# Altium project ECEN404_FinalPCB.PrjPcb
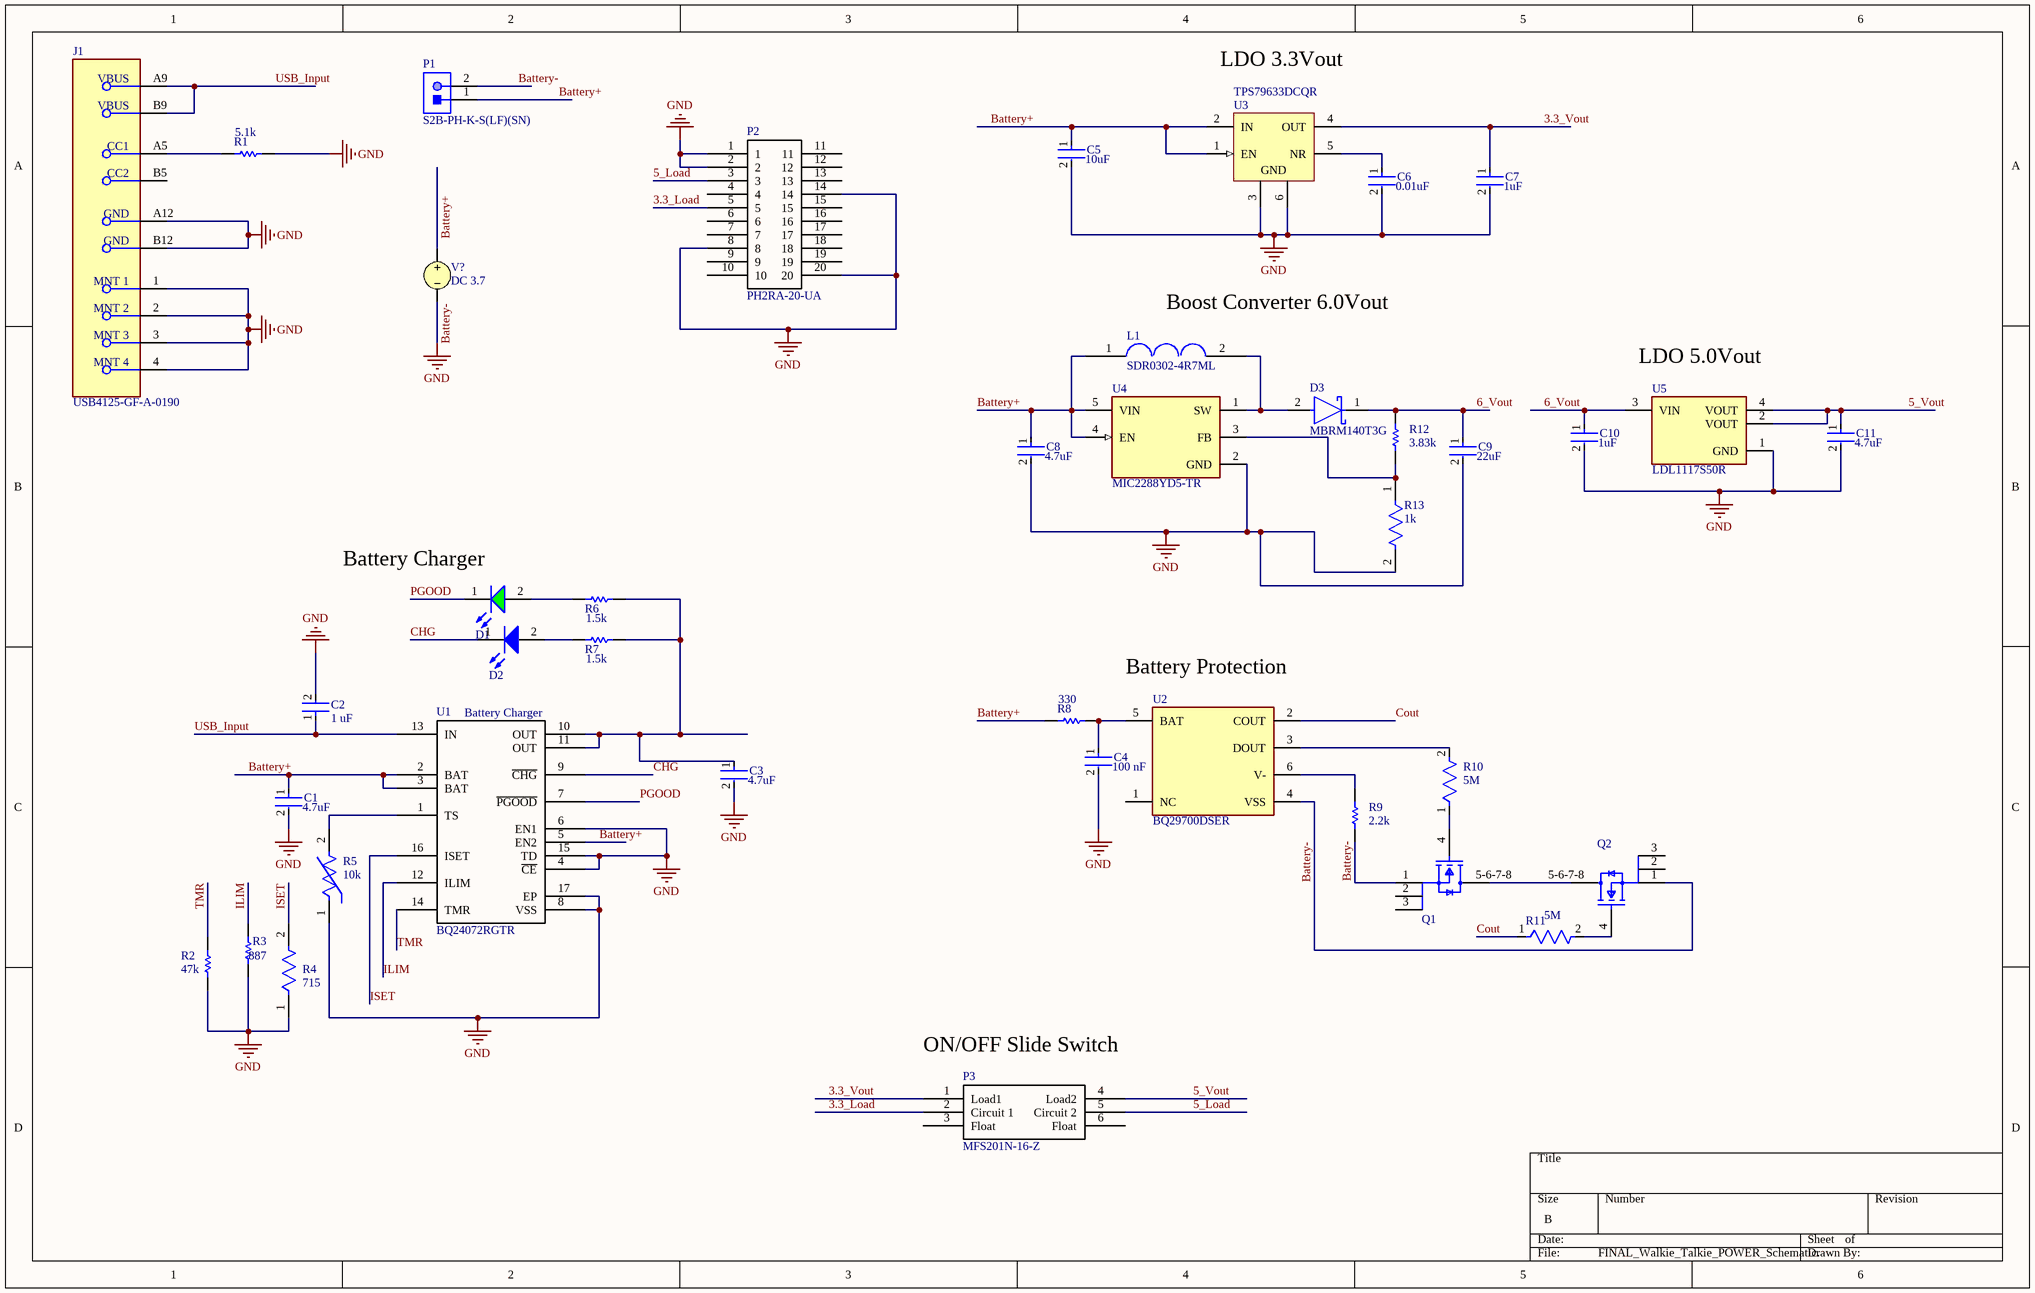
[diagram p0: FINAL_Walkie_Talkie_POWER_Schematic.SchDoc]
1 sheet, 40 parts. Net scope: global (net labels, ports and power ports of the same name join across sheets).
Board file: FINAL_Walkie_Talkie_POWER_PCB.PcbDoc

## Sheet FINAL_Walkie_Talkie_POWER_Schematic.SchDoc
size B; SheetNumber: 1; SheetTotal: 1

### Parts
C1  Capacitance: 4.7uF  [FP-0805-L_2_01_0_2-W_1_25-IPC_B]  (hidden comment: 08056D475MAT2A)
C2  Capacitance: 1 uF  [FP-CC0805-0_85-MFG]  (hidden comment: CC0805KKX7R7BB105)
C3  Capacitance: 4.7uF  [FP-0805-L_2_01_0_2-W_1_25-IPC_B]  (hidden comment: 08056D475MAT2A)
C4  value 100 nF  [FP-CC0603-DA-MFG]  (hidden comment: CC0603KRX7R7BB104)
C5  Capacitance: 10uF  [FP-GRM21B-0_1-MFG]  (hidden comment: GRM21BR61C106KE15K)
C6  Capacitance: 0.01uF  [FP-0603B103K500CT-IPC_C]  (hidden comment: 0603B103K500CT)
C7  Capacitance: 1uF  [FP-CL10-IPC_C]  (hidden comment: CL10B105KP8NNNC)
C8  Capacitance: 4.7uF  [FP-0805-L_2_01_0_2-W_1_25-IPC_B]  (hidden comment: 08056D475MAT2A)
C9  Capacitance: 22uF  [FP-CL21-IPC_A]  (hidden comment: CL21A226MQQNNNE)
C10  Capacitance: 1uF  [FP-CL10-IPC_C]  (hidden comment: CL10B105KP8NNNC)
C11  Capacitance: 4.7uF  [FP-0805-L_2_01_0_2-W_1_25-IPC_B]  (hidden comment: 08056D475MAT2A)
D1  150060GS75000  [WL-SMCW_0603_150060xx75000]  (value not drawn)
D2  150060BS75000  [WL-SMCW_0603_150060xx75000]  (value not drawn)
D3  MBRM140T3G  [FP-457-04-MFG]
J1  USB4125-GF-A-0190  [FP-USB4125-GF-A-0190-MFG]
L1  SDR0302-4R7ML  [SDR0302-4R7ML]
P1  S2B-PH-K-S(LF)(SN)  [JST-S2B-PH-K-S_V]
P2  PH2RA-20-UA  [PH2RA-20-UA]
P3  MFS201N-16-Z  [MFS201N-16-Z]
Q1  CSD16406Q3  [FP-DQG0008A-MFG]  (value not drawn)
Q2  CSD16406Q3  [FP-DQG0008A-MFG]  (value not drawn)
R1  RC0603FR-075K1L  [RESC1608X55X25ML10T15]  (value not drawn)
R2  RC0805FR-0747KL  [RESC2013X60X35NL10T20]  (value not drawn)
R3  RC0805FR-07887RL  [RESC2013X60X35ML10T20]  (value not drawn)
R4  Resistance: 715  [FP-RC0805-0_6-MFG]  (hidden comment: RC0805FR-07715RL)
R5  NCU18XH103F60RB  [FP-NCU18-0_15-MFG]  (value not drawn)
R6  RC0805FR-071K5L  [RESC2013X60X35LL10T20]  (value not drawn)
R7  RC0805FR-071K5L  [RESC2013X60X35LL10T20]  (value not drawn)
R8  Resistance: 330  [RESC2013X60X35LL10T20]  (hidden comment: RC0805FR-07330RL)
R9  Resistance: 2.2k  [RESC1608X55X25LL10T15]  (hidden comment: RC0603FR-072K2L)
R10  Resistance: 5M  [FP-RG3216-MFG]  (hidden comment: RG3216P-5004-B-T1)
R11  Resistance: 5M  [FP-RG3216-MFG]  (hidden comment: RG3216P-5004-B-T1)
R12  ERJ-3EKF3831V  [RESC1608X55X30NL15T15]  (value not drawn)
R13  Resistance: 1k  [FP-RC0603-0_55-IPC_C]  (hidden comment: RC0603FR-071KL)
U1  BQ24072RGTR  [BQ24072RGTR]
U2  BQ29700DSER  [FP-DSE0006A-IPC_B]
U3  TPS79633DCQR  [DCQ0006A_L]
U4  MIC2288YD5-TR  [FP-TSOT-5LD-PL-1-MFG]
U5  LDL1117S50R  [FP-SOT-223-0046067_14-MFG]
V?  DC 3.7

### Nets
Battery-: C1.2 C2.2 C3.2 C4.2 C5.2 C6.2 C7.2 C8.2 C9.2 C10.2 C11.2 J1.1(MNT_1) J1.2(MNT_2) J1.3(MNT_3) J1.4(MNT_4) J1.A12(GND) J1.B12(GND) P1.2 P2.1 P2.2 P2.8 P2.14 P2.20 Q1.1(S) Q2.1(S) R1.2 R2.1 R3.1 R4.1 R5.1 R9.1 R13.2 U1.4(~{CE}) U1.6(EN1) U1.8(VSS) U1.15(TD) U1.17(EP) U2.4(VSS) U3.3(GND) U3.6(GND) U4.2(GND) U5.1(GND) V?.2  [also labelled GND]
3.3_Load: P2.5 P3.2(Circuit_1)
3.3_Vout: C7.1 P3.1(Load1) U3.4(OUT)
5_Load: P2.3 P3.5(Circuit_2)
5_Vout: C11.1 P3.4(Load2) U5.2(VOUT) U5.4(VOUT)
6_Vout: C9.1 C10.1 D3.1(C) R12.2 U5.3(VIN)
Battery+: C1.1 C5.1 C8.1 L1.1 P1.1 R8.2 U1.2(BAT) U1.3(BAT) U1.5(EN2) U3.1(EN) U3.2(IN) U4.4(EN) U4.5(VIN) V?.1
CHG: D2.1(K) U1.9(~{CHG})
Cout: R11.1 U2.2(COUT)
ILIM: R3.2 U1.12(ILIM)
ISET: R4.2 U1.16(ISET)
PGOOD: D1.1(K) U1.7(~{PGOOD})
TMR: R2.2 U1.14(TMR)
USB_Input: C2.1 J1.A9(VBUS) J1.B9(VBUS) U1.13(IN)
NetC3_1: C3.1 R6.2 R7.2 U1.10(OUT) U1.11(OUT)
NetC4_1: C4.1 R8.1 U2.5(BAT)
NetC6_1: C6.1 U3.5(NR)
NetD1_2: D1.2(A) R6.1
NetD2_2: D2.2(A) R7.1
NetD3_2: D3.2(A) L1.2 U4.1(SW)
NetJ1_A5: J1.A5(CC1) R1.1
NetQ1_4: Q1.4(G) R10.1
NetQ1_5-6-7-8: Q1.5-6-7-8(D) Q2.5-6-7-8(D)
NetQ2_4: Q2.4(G) R11.2
NetR5_2: R5.2 U1.1(TS)
NetR9_2: R9.2 U2.6(V-)
NetR10_2: R10.2 U2.3(DOUT)
NetR12_1: R12.1 R13.1 U4.3(FB)

Not connected (* = marked no-connect by the designer): J1 B5(CC2); P2 4 6 7 9 10 11 12 13 15 16 17 18 19; P3 3(Float) 6(Float); Q1 2(S) 3(S); Q2 2(S) 3(S); U2 1(NC)

### Notes on the sheet
- LDO 3.3Vout
- (near R1) 5.1k
- (near L1) Boost Converter 6.0Vout
- (near U5) LDO 5.0Vout
- 3.83k
- (near D1) Battery Charger
- 1.5k
- (near R7) 1.5k
- Battery Protection
- (near U1) Battery Charger
- (near R5) 10k
- (near R2) 47k
- (near R3) 887
- (near P3) ON/OFF Slide Switch

### Library data of the parts
C1 C3 C8 C11 = CMP-2007-04650-2: General Purpose Ceramic Capacitor, 0805, 4.7uF, 20%, X5R, 15%, 6.3V; Voltage Rating (DC): 6.3V; Package Quantity: 1; Case Code (Metric): 2012; Mount: Surface Mount; Lead Free: Lead Free; Series: -; Tolerance: 20%; Height: 1.4mm; Min Operating Temperature: -55°C; Termination: SMD/SMT; Width: 0.049inch; Case/Package: 0805; Dielectric: X5R; Packaging: Tape and Reel; Thickness: 0.055inch; Length: 2.01mm; Number of Pins: 2; Depth: 1.25mm; Radiation Hardening: No; Case Code (Imperial): 0805; Max Operating Temperature: 85°C; Voltage Rating: 6.3V; Construction: Flat; RoHS Compliant: Yes
C2 = CMP-03422-000001-1: CAP CER 1UF 16V X7R 0805; Manufacturer: Yageo; Material: Ceramic; Tolerance: 0.1; Voltage Rating: 16 V; Category: Cap; ComponentLink2Description: Datasheet; Automotive: No; Temperature Range High: +85°C; RoHS: TRUE; Footprint Url: http://www.yageo.com/exep/pages/download/literatures/UPY-C_GEN_24.pdf; Mouser Description: Multilayer Ceramic Capacitors MLCC - SMD/SMT 1.0uF 16V X7R 10%; Height: 0.95mm; Ipc Land Pattern Name: CAPC200125X85; Temperature: -30°C to +85°C; Lead Free: Yes; Value: 1 uF; Temperature Characteristic: X7R; Package: CC0805-0.85; Temperature Range Low: -30°C; Device Class L1: Passive Components; Device Class L3: Ceramic Capacitors; Octopart: https://octopart.com/cc0805kkx7r7bb105-yageo-8376555; Manufacturer Part Number: CC0805KKX7R7BB105; ComponentLink2URL: http://www.yageo.com/documents/recent/UPY-GPHC_Y5V_6.3V-to-50V_8.pdf; Device Class L2: Capacitors; Digikey Description: CAP CER 1UF 16V X7R 0805
C4 = CMP-2000-05002-2: CAP CER 0.1UF 16V X7R 0603; Manufacturer: YAGEO; Tolerance: 0.1; Temperature Coefficient: 15%; Material: Ceramic; Voltage Rating: 16 V; Package: CC0603-DA; ComponentLink2Description: Datasheet; Octopart: https://octopart.com/cc0603krx7r7bb104-yageo-192941; Temperature Range High: +125°C; Digikey Description: CAP CER 0.1UF 16V X7R 0603; Voltage: 16 V; Device Class L2: Capacitors; Height: 0.9mm; Temperature: -55°C to +125°C; Manufacturer Part Number: CC0603KRX7R7BB104; Device Class L1: Passive Components; Device Class L3: Ceramic Capacitors; ComponentLink2URL: http://www.yageo.com/documents/recent/UPY-GPHC_X7R_6.3V-to-50V_18.pdf; Footprint Url: http://www.yageo.com/exep/pages/download/literatures/UPY-C_GEN_24.pdf; RoHS: TRUE; Temperature Range Low: -55°C; Temperature Characteristic: X7R; Lead Free: Yes; Capacitance: 100 nF; Category: Cap; Mouser Description: Multilayer Ceramic Capacitor, CC Series, 0.1 - F, - 10%, X7R, 16 V, 0603 [1608 Metric]; Automotive: No
C5 = CMP-2007-03534-2: Chip Multilayer Ceramic Capacitors for General Purpose, 0805, 10uF, X5R, 15%, 10%, 16V; Case Code (Imperial): 0805; Packaging: Tape and Reel; Width: 0.049inch; Depth: 1.25mm; Voltage Rating: 16V; Height: 1.25mm; Case/Package: 0805; Max Operating Temperature: 85°C; Min Operating Temperature: -55°C; Tolerance: 10%; Dielectric: X5R; REACH SVHC: No SVHC; Mount: Surface Mount; Radiation Hardening: No; Case Code (Metric): 2012; Length: 2mm; Package Quantity: 10000; Voltage Rating (DC): 16V; Voltage: 16V; Thickness: 0.053inch; Termination: SMD/SMT
C6 = CMP-45632-000011-1: CAP CER 10000PF 50V X7R 0603; Tolerance: 10%; Insulation Resistance: 10GR; Dissipation Factor: 2.5%; Height: 0.8mm; Series: -; Lead Free: Lead Free; Voltage Rating (DC): 50V; Radiation Hardening: No; Dielectric: X7R; Length: 1.6mm; Termination: SMD/SMT; Case Code (Metric): 1608; Width: 0.8mm; Depth: 0.8mm; RoHS Compliant: Yes; Packaging: Tape and Reel; Case/Package: 0603; Voltage Rating: 50V; Max Operating Temperature: 125°C; Case Code (Imperial): 0603; Package Quantity: 4000; Min Operating Temperature: -55°C
C7 C10 = CMP-2000-06094-2: Cap Ceramic 1uF 10V X7R ±10% Pad SMD 0603 +125°C T/R; Packaging: Tape and Reel; Depth: 0.8mm; Voltage Rating: 10V; Lead Free: Lead Free; Radiation Hardening: No; Length: 1.6mm; Package Quantity: 1; Mount: Surface Mount; Case/Package: 0603; Max Operating Temperature: 125°C; Case Code (Metric): 1608; Height: 0.8mm; Min Operating Temperature: -55°C; Dielectric: X7R; Contact Plating: Tin; Case Code (Imperial): 0603; Thickness: 0.035inch; Voltage Rating (DC): 10V; Tolerance: 10%; Width: 0.031inch
C9 = CMP-13271-000185-1: CL21 Series 0805 22uF 6.3V ±20% Tolerance X5R Multilayer Ceramic Chip Capacitor; Height: 1.25mm; Length: 2mm; Mount: Surface Mount; Dielectric: X5R; Voltage Rating (DC): 6.3V; Case Code (Metric): 2012; Depth: 1.25mm; Max Operating Temperature: 85°C; Voltage Rating: 6.3V; Width: 0.049inch; Case/Package: 0805; Radiation Hardening: No; Thickness: 0.055inch; Packaging: Tape and Reel; Package Quantity: 2000; Lead Free: Lead Free; Contact Plating: Tin; Min Operating Temperature: -55°C; Case Code (Imperial): 0805; Tolerance: 20%
D1 = CMP-1426-00002-4: 430mcd Colorless transparence 520nm Emerald 140° LED0603 Light Emitting Diodes (LED) ROHS; Peak Wavelength: 515nm; Forward Current: 100mA; Reverse Voltage: 5V; Output Current: 10µA; Power Dissipation: 105mW; Lens Style: Clear, Rectangular; Dominant Wavelength: 525nm; Color: Green; Test Current: 20mA; Max Junction Temperature (Tj): 95°C; Forward Voltage: 3.2V; Width: 800µm; Max Operating Temperature: 85°C; Case Code (Metric): 1608; Luminous Intensity: 430mcd; Lead Free: Lead Free; Case/Package: 0603; Case Code (Imperial): 0603; Mount: Surface Mount; Max Reverse Voltage (DC): 5V; Packaging: Tape and Reel; RoHS: Compliant; Viewing Angle: 140°; REACH SVHC: Unknown; Min Operating Temperature: -40°C; Height: 700µm; Wavelength: 525nm; Length: 1.6mm
D2 = CMP-1426-00003-4: Led, Blue, 470 Nm, 3.2 V, 30 Ma, 145 Mcd Rohs Compliant: Yes; Peak Wavelength: 465nm; Dominant Wavelength: 470nm; Power Dissipation: 105mW; Viewing Angle: 140°; Test Current: 20mA; Max Junction Temperature (Tj): 95°C; Forward Current: 100mA; Reverse Voltage: 5V; Luminous Intensity: 145mcd; Lens Style: Clear, Rectangular; Forward Voltage: 3.2V; RoHS: Compliant; Min Operating Temperature: -40°C; REACH SVHC: Unknown; Max Operating Temperature: 85°C; Width: 800µm; Case Code (Imperial): 0603; Case Code (Metric): 1608; Max Reverse Voltage (DC): 5V; Height: 700µm; Case/Package: 0603; Mount: Surface Mount; Packaging: Tape and Reel; Color: Blue; Wavelength: 470nm; Length: 1.6mm
D3 = CMP-1055-00293-2: DIODE SCHOTTKY 40V 1A POWERMITE; Peak Non-Repetitive Surge Current: 50A; Forward Voltage: 550mV; Element Configuration: Single; Peak Reverse Current: 500uA; Polarity: Standard; Output Current: 1A; Number of Pins: 2; Lead Free: Lead Free; Package Quantity: 1; Width: 2.18mm; Current Rating: 1A; Min Operating Temperature: -55°C; Halogen Free: Halogen Free; Voltage Rating (DC): 40V; Max Repetitive Reverse Voltage (Vrrm): 40V; Forward Current: 1A; Radiation Hardening: No; Length: 2.05mm; Max Surge Current: 50A; Max Reverse Leakage Current: 500uA; Case/Package: 457; Packaging: Tape and Reel; Max Operating Temperature: 125°C; REACH SVHC: No SVHC; Height: 1.15mm; Max Forward Surge Current (Ifsm): 50A; Contact Plating: Tin; Average Rectified Current: 1A; Max Reverse Voltage (DC): 40V
J1 = CMP-245163-000004-1: CONN RCPT TYPE C 6P SMD RA
P1 = CMP-1755-00004-1: Male Header, Pitch 2 mm, 1 x 2 Position, Height 4.8 mm, Tail Length 3.4 mm, -25 to 85 degC, RoHS, Bulk; Case\Package: Radial; Tolerance: 20%; Capacitance: 10 uF; Voltage Rating (DC): 50 V; Packaging: Bulk; ComponentLink1URL: http://www.jst-mfg.com/product/pdf/eng/ePH.pdf; Radiation Hardening: No; Height: 11 mm; Package Quantity: 200; PackageDescription: Male Header, Pitch 2 mm, 1 x 2 Position, Height 4.8 mm, Tail Length 3.4 mm; PackageReference: S2B-PH-K-S; Diameter: 5 mm; Pins: 2; Mount: Through Hole; Max Operating Temperature: 85 degC; Min Operating Temperature: -40 degC; ComponentLink1Description: Datasheet; DatasheetVersion: Dec-12; Length: 11 mm; Lead Pitch: 2 mm; REACH SVHC: No SVHC; Voltage Rating: 50 V; RoHSCompliant: true
P3 = MFS201N-16-Z: Slide Switch Right Angle
Q1 Q2 = CMP-04962-000044-1: MOSFET N-CH 25V 60A 8-SON; Nominal Vgs: 1.7V; Power Dissipation: 2.7W; Element Configuration: Single; Input Capacitance: 1.1nF; Turn-Off Delay Time: 8.5ns; Number of Elements: 1; Rise Time: 12.9ns; Turn-On Delay Time: 7.3ns; Rds On Max: 5.3mR; Polarity: N-CHANNEL; Gate to Source Voltage (Vgs): 16V; Fall Time: 4.8ns; REACH SVHC: No SVHC; Max Operating Temperature: 150°C; Lead Free: Contains Lead; Contact Plating: Tin; Radiation Hardening: No; Series: NexFET™; Dual Supply Voltage: 25V; Mount: Surface Mount; Continuous Drain Current (ID): 60A; Threshold Voltage: 1.7V; RoHS Compliant: Yes; Package Quantity: 1; Min Operating Temperature: -55°C; Packaging: Tape and Reel; Number of Pins: 8; Termination: SMD/SMT; Max Power Dissipation: 2.7W; Case/Package: SON; Drain to Source Breakdown Voltage: 25V; Drain to Source Voltage (Vdss): 25V
R1 = CMP-2000-04091-1: Manufacturer: Yageo; Part Number: RC0603FR-075K1L
R2 = CMP-1659-00011-4: Chip Resistor, 47 KOhm, +/- 1%, 0.125 W, -55 to 155 degC, 0805 (2012 Metric), RoHS, Tape and Reel; Manufacturer: Yageo; Voltage Rating: 150 V; Height: 0.5 mm; ComponentLink2URL: http://www.yageo.com/documents/recent/PYu-RC_Group_51_RoHS_L_04.pdf; ComponentLink2Description: Datasheet; Package Quantity: 200; Max Operating Temperature: 155 degC; Min Operating Temperature: -55 degC; Packaging: Tape and Reel; Pins: 2; PackageReference: 0805; Mounting Technology: Surface Mount; ComponentLink1Description: Manufacturer URL; ComponentLink1URL: http://www.yageo.com/; PackageDescription: 2-Pin Surface Mounted Device, Body 2 x 1.25 mm; Length: 2 mm; REACH SVHC: No SVHC; Mount: Surface Mount; RoHSCompliant: true; DatasheetVersion: Rev. 4, 02/2016
R3 = CMP-2001-01292-1: Manufacturer: Yageo; Part Number: RC0805FR-07887RL
R4 = CMP-2001-01257-3: RES 715 OHM 1% 1/8W 0805; Max Power Dissipation: 125mW; Voltage Rating (DC): 150V; Temperature Coefficient: 100ppm/°C; Power Rating: 125mW; Packaging: Tape and Reel; Tolerance: 1%; Case Code (Imperial): 0805; Depth: 1.25mm; Size Code: 0805; Min Operating Temperature: -55°C; Features: Moisture Resistant; Height: 0.024inch; RoHS Compliant: Yes; Max Operating Temperature: 155°C; Length: 0.079inch; Number of Terminations: 2; Package Quantity: 1; Width: 0.049inch; Resistor Type: Thick Film; Lead Free: Lead Free; Contact Plating: Tin; Military Standard: Not; Case/Package: 0805; Voltage Rating: 150V; Case Code (Metric): 2012; Series: RC; Radiation Hardening: No; Termination: SMD/SMT; Construction: Rectangular
R5 = CMP-06022-000443-2: THERMISTOR NTC; Max Operating Temperature: 125°C; REACH SVHC: No SVHC; Case/Package: 0603; Min Operating Temperature: -40°C; RoHS Compliant: Yes; Case Code (Imperial): 0603; Case Code (Metric): 1608
R6 R7 = CMP-1659-00010-2: RES 1.50K OHM 1/8W 1% 0805 SMD; Manufacturer: Yageo; PackageReference: 0805; ComponentLink1URL: http://www.yageo.com/documents/recent/PYu-RC_Group_51_RoHS_L_04.pdf; ComponentLink1Description: Datasheet; PartNumber: RC0805FR-071K5L
R8 = CMP-2000-06960-1: Chip Resistor, 330 Ohm, +/- 1%, 125 mW, -55 to 155 degC, 0805 (2012 Metric), RoHS, Tape and Reel; Manufacturer: Yageo; Voltage Rating: 150V; Temperature Coefficient: 100PPM/C; Power Rating: 125mW(1/8W); Datasheet Version: Rev. 7, 05/2017; Termination Style: SMD/SMT; Case Code - mm: 2012; Package Description: 2-Pin Surface Mounted Device, Body 2 x 1.25 mm; Operating Temperature Range: -55Cto+155C; Case Code - in: 0805; Packaging: Reel; Tolerance: 1%; Package Reference: 0805; Mounting Technology: SurfaceMount; Product: ThickFilmResistorsGeneralPurpose; Series: RC; Manufacturer URL: http://www.yageo.com/; Datasheet URL: http://www.yageo.com/documents/recent/PYu-RC_Group_51_RoHS_L_7.pdf
R9 = CMP-2000-06934-1: Thick Film Resistor, 2.2 KOhm, 100 mW, 50 V, +/- 1%, -55 to 155 degC, 2-Pin SMD (0603), RoHS, Tape and Reel; Manufacturer: Yageo; Temperature Coefficient: 100PPM/C; Voltage Rating: 50V; Power Rating: 100mW; Tolerance: 1%; Datasheet Version: Rev. 7, 05/2017; Case Code - mm: 1608; Series: RC; Mounting Technology: SurfaceMount; Package Description: 2-Pin Surface Mount Device, Body 1.6 x 0.8 mm; Case Code - in: 0603; Package Reference: 0603; Product: ThickFilmResistorsGeneralPurpose; Manufacturer URL: http://www.yageo.com/; Termination Style: SMD/SMT; Operating Temperature Range: -55Cto+155C; Datasheet URL: http://www.yageo.com/documents/recent/PYu-RC_Group_51_RoHS_L_7.pdf; Packaging: Reel
R10 R11 = CMP-00597-81680123-1: Fixed Resistor, Thin Film, 0.25W, 5000000ohm, 200V, 0.1% +/-Tol, 25ppm/Cel, Surface Mount, 1206; Temperature Coefficient: 25ppm/°C; Power Rating: 250mW; Case/Package: 1206; Max Operating Temperature: 155°C; Voltage Rating: 200V; Case Code (Metric): 3216; Lead Free: Lead Free; Voltage Rating (DC): 200V; Tolerance: 0.1%; RoHS: Non-Compliant; Min Operating Temperature: -55°C; Composition: Thin Film; Height: 500µm
R12 = CMP-2000-00471-1: Manufacturer: Panasonic; Part Number: ERJ-3EKF3831V
R13 = CMP-1659-00009-5: RES 1K OHM 1% 1/10W 0603; Voltage Rating: 50V; Power Rating: 100mW; Temperature Coefficient: 100ppm/°C; Military Standard: Not; REACH SVHC: No SVHC; Size Code: 0603; Features: Moisture Resistant; Number of Terminations: 2; Technology: THICK FILM; Series: RC; Case Code (Metric): 1608; Resistance Tolerance: 1%; Resistor Type: Thick Film; Termination: SMD/SMT; Contact Plating: Tin; Radiation Hardening: No; Min Operating Temperature: -55°C; Max Operating Temperature: 155°C; Packaging: Tape and Reel; Max Power Dissipation: 100mW; RoHS Compliant: Yes; Height: 0.45mm; Lead Free: Lead Free; Case/Package: 0603; Length: 1.6mm; Tolerance: 1%; Case Code (Imperial): 0603; Construction: Rectangular; Depth: 0.8mm
U1 = BQ24072RGTR: IC BATT CHG LI-ION 1CELL 16QFN
U2 = CMP-04911-000043-1: IC LITHIUM BATT PROTECT 6-SON; Number of Cells: 1; Fault Protection: Over Current; Operating Supply Voltage: 8V; Packaging: Tape and Reel; RoHS Compliant: Yes; Contact Plating: Gold; Lead Free: Lead Free; Min Operating Temperature: -40°C; Number of Pins: 6; Max Operating Temperature: 85°C; Package Quantity: 3000; Mount: Surface Mount; Weight: 0.000342oz
U3 = CMP-0395-00327-2: Single Output High PSRR LDO, 1 A, Fixed 3.3 V Output, 2.7 to 5.5 V Input, 6-pin SOT-223 (DCQ), -40 to 125 degC, Green (RoHS & no Sb/Br); Manufacturer: Texas Instruments; Accuracy(%): 2; Iout(Max)(A): 1; Vdo(Typ)(mV): 220; SubFamily: Single Channel LDO; Vout Adj(Min)(V): 3.3; Vin(Max)(V): 5.5; Iq(Typ)(mA): 0.26; Vin(Min)(V): 2.7; DatasheetVersion: SLVS351N; ComponentLink2Description: Datasheet; PartNumber: TPS79633DCQR; PackageDescription: 6-Pin Plastic Small Outline, Body 3.5 x 6.5 mm, Pitch 1.27 mm; ComponentLink1Description: Manufacturer URL; ComponentLink2URL: http://www.ti.com/general/docs/lit/getliterature.tsp?genericPartNumber=TPS79633&fileType=pdf; ComponentLink3URL: http://www.ti.com/litv/pdf/mpds098c; Mounting Technology: Surface Mount; Fixed Output Options(V): 3.3; PackageReference: DCQ0006A; ComponentLink1URL: http://www.ti.com/; PackageVersion: 4202109/D; ComponentLink3Description: Package Specification; Vout Adj(Max)(V): 3.3; Eco-Plan: Green (RoHS & no Sb/Br)
U4 = CMP-06325-000011-1: IC REG BOOST ADJ 1.2A TSOT23-5; Number of Outputs: 1; Output Current: 1A; Operating Supply Voltage: 10V; Switching Frequency: 1.2MHz; Output Configuration: Positive; Max Output Voltage: 34V; Min Input Voltage: 2.5V; Synchronous Rectifier: No; Output Type: Adjustable; Max Input Voltage: 10V; Width: 1.6mm; Max Output Current: 1A; Packaging: Tape and Reel; Max Operating Temperature: 125°C; Min Operating Temperature: -40°C; Package Quantity: 3000; Height: 0.87mm; Output Voltage: 34V; Min Output Voltage: 2.5V; Lead Free: Lead Free; Length: 2.9mm; REACH SVHC: No SVHC; Radiation Hardening: No; Min Supply Voltage: 2.5V; Case/Package: TSOT; Number of Pins: 5; Mount: Surface Mount; Topology: Boost
U5 = CMP-12153-000005-1: IC REG LINEAR 5V 1.2A SOT223; Manufacturer: STMicroelectronics; Standoff Height: 0.02mm; Min Supply Voltage: 2.6V; Nominal Supply Current: 250uA; Max Junction Temp: +150°C; Accuracy Percentage: 2%; Output Type: Fixed; Max Supply Voltage: 18V; Output Current: 2A; Number Of Outputs: 1; Dropout Voltage: 350mV; ComponentLink2Description: Datasheet; Temperature Range High: +125°C; Manufacturer Part Number: LDL1117S50R; Digikey Description: IC REG LINEAR 5V 1.2A SOT223; Device Class L2: Power Management ICs; RoHS: TRUE; Temperature: -40°C to +125°C; Device Class L3: Voltage Regulators - Linear; Automotive: No; Mouser Description: LDL1117 Series 1.2 A 5 V High PSRR LDO Linear Voltage Regulator - SOT-223; Package: SOT-223-0046067_14; ComponentLink2URL: https://www.st.com/content/ccc/resource/technical/document/datasheet/group3/0e/5a/00/ca/10/1a/4f/a5/DM00366442/files/DM00366442.pdf/jcr:content/translations/en.DM00366442.pdf; Output Voltage: 5V; Octopart: https://octopart.com/ldl1117s50r-stmicroelectronics-81876164; Category: IC; Device Class L1: Integrated Circuits (ICs); Temperature Range Low: -40°C; Height: 1.9mm; Lead Free: Yes
V? = VSRC: Voltage Source; Note: PCB Footprint - Not required; AC Magnitude: 1; AC Phase: 0; Value: 3.7; Published: 8-Jun-2000; LatestRevisionDate: 17-Jul-2002; LatestRevisionNote: Re-released for DXP Platform.; PackageReference: Not Applicable; Publisher: Altium Limited